# EAGLE design Tesseract (EAGLE 9.2.1)
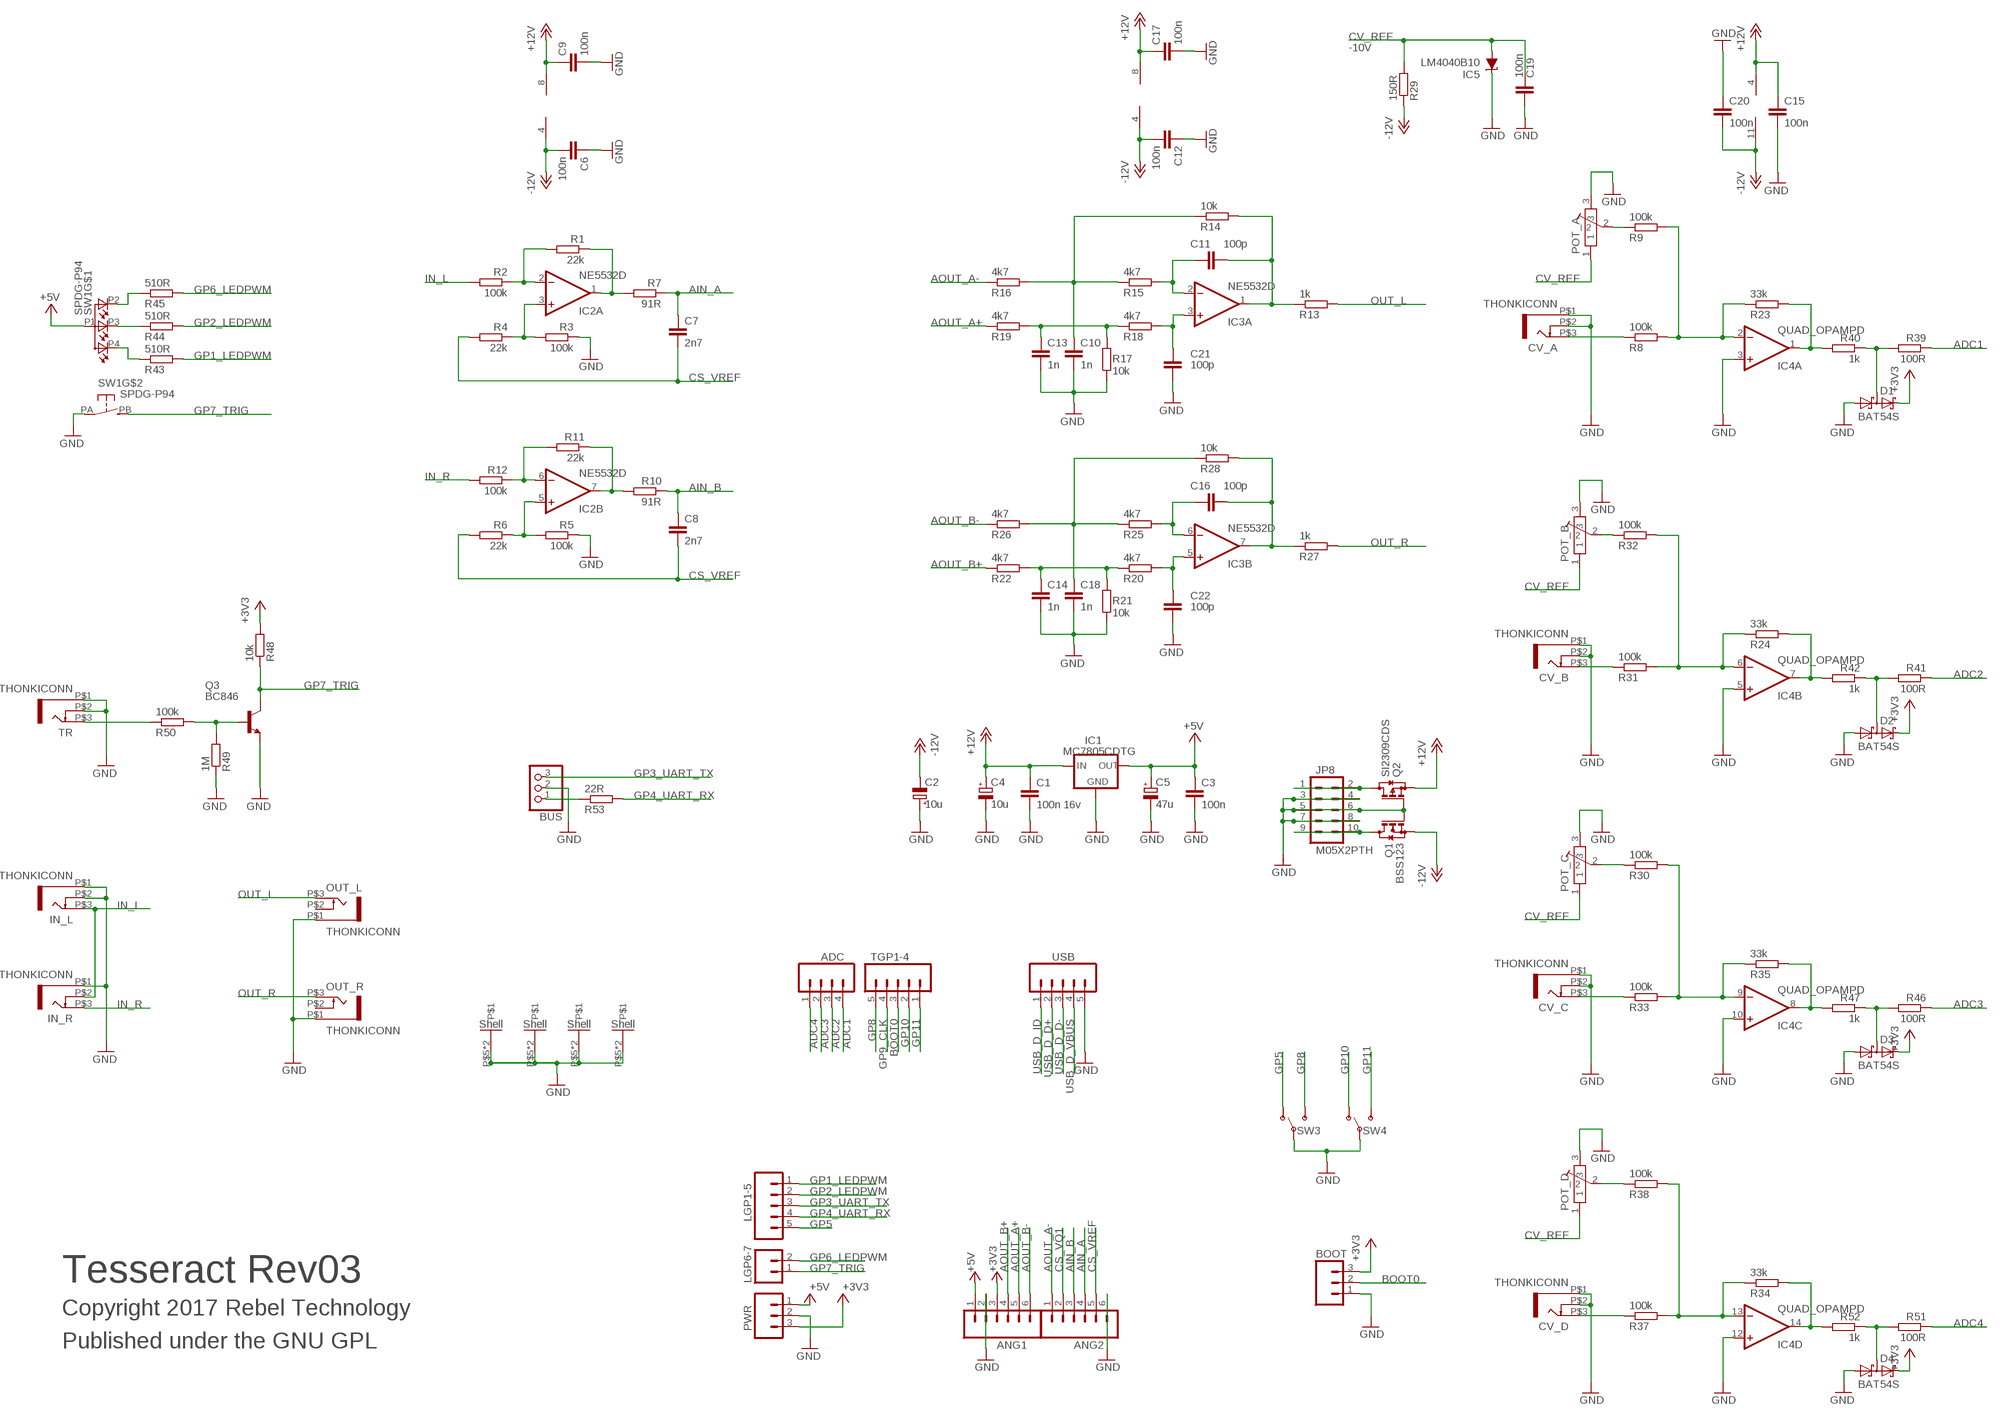
[diagram p0: schematic, sheet 1]

## Parts
ADC  M04PTH  [1X04]
ANG1  M06SIP  [1X06]
ANG2  M06SIP  [1X06]
BOOT  M03PTH  [1X03]
BUS  CON-JST-1X03PH-TH  [JST-B3B-PH-KL]
C1  100n 16v  C-EUC0603  [C0603]
C2  10u  CPOL-EU153CLV-0505  [CPOL-5]
C3  100n  C-EUC0603  [C0603]
C4  10u  CPOL-EU153CLV-0505  [CPOL-5]
C5  47u  CPOL-EUC  [PANASONIC_C]
C6  100n  C-EUC0603  [C0603]
C7  2n7  C-EUC0603  [C0603]
C8  2n7  C-EUC0603  [C0603]
C9  100n  C-EUC0603  [C0603]
C10  1n  C-EUC0603  [C0603]
C11  100p  C-EUC0603  [C0603]
C12  100n  C-EUC0603  [C0603]
C13  1n  C-EUC0603  [C0603]
C14  1n  C-EUC0603  [C0603]
C15  100n  C-EUC0603  [C0603]
C16  100p  C-EUC0603  [C0603]
C17  100n  C-EUC0603  [C0603]
C18  1n  C-EUC0603  [C0603]
C19  100n  C-EUC0603  [C0603]
C20  100n  C-EUC0603  [C0603]
C21  100p  C-EUC0603  [C0603]
C22  100p  C-EUC0603  [C0603]
CV_A  THONKICONN  [THONKICONN]
CV_B  THONKICONN  [THONKICONN]
CV_C  THONKICONN  [THONKICONN]
CV_D  THONKICONN  [THONKICONN]
D1  BAT54S  [SOT23]
D2  BAT54S  [SOT23]
D3  BAT54S  [SOT23]
D4  BAT54S  [SOT23]
IC1  MC7805CDTG  MC78XX  [DPACK]
IC2  NE5532D  [SO08]
IC3  NE5532D  [SO08]
IC4  QUAD_OPAMPD  [SO14]
IC5  LM4040B10  LM4041C12DBZ  [DBZ_R-PDSO-G3]
IN_L  THONKICONN  [THONKICONN]
IN_R  THONKICONN  [THONKICONN]
JP8  M05X2PTH  [AVR_ICSP]
LGP1-5  M05PTH  [1X05]
LGP6-7  M02PTH  [1X02]
OUT_L  THONKICONN  [THONKICONN]
OUT_R  THONKICONN  [THONKICONN]
POT_A  POT-ALPS-RK09L1140  [POT-ALPS-RK09L1140]
POT_B  POT-ALPS-RK09L1140  [POT-ALPS-RK09L1140]
POT_C  POT-ALPS-RK09L1140  [POT-ALPS-RK09L1140]
POT_D  POT-ALPS-RK09L1140  [POT-ALPS-RK09L1140]
PWR  M03PTH  [1X03]
Q1  BSS123  [SOT23]
Q2  SI2309CDS  BSS84  [SOT23]
Q3  BC846  [SOT23]
R1  22k  R-EU_0603  [0603]
R2  100k  R-EU_0603  [0603]
R3  100k  R-EU_0603  [0603]
R4  22k  R-EU_0603  [0603]
R5  100k  R-EU_0603  [0603]
R6  22k  R-EU_0603  [0603]
R7  91R  R-EU_0603  [0603]
R8  100k  R-EU_0603  [0603]
R9  100k  R-EU_0603  [0603]
R10  91R  R-EU_0603  [0603]
R11  22k  R-EU_0603  [0603]
R12  100k  R-EU_0603  [0603]
R13  1k  R-EU_0603  [0603]
R14  10k  R-EU_0603  [0603]
R15  4k7  R-EU_0603  [0603]
R16  4k7  R-EU_0603  [0603]
R17  10k  R-EU_0603  [0603]
R18  4k7  R-EU_0603  [0603]
R19  4k7  R-EU_0603  [0603]
R20  4k7  R-EU_0603  [0603]
R21  10k  R-EU_0603  [0603]
R22  4k7  R-EU_0603  [0603]
R23  33k  R-EU_0603  [0603]
R24  33k  R-EU_0603  [0603]
R25  4k7  R-EU_0603  [0603]
R26  4k7  R-EU_0603  [0603]
R27  1k  R-EU_0603  [0603]
R28  10k  R-EU_0603  [0603]
R29  150R  R-EU_0603  [0603]
R30  100k  R-EU_0603  [0603]
R31  100k  R-EU_0603  [0603]
R32  100k  R-EU_0603  [0603]
R33  100k  R-EU_0603  [0603]
R34  33k  R-EU_0603  [0603]
R35  33k  R-EU_0603  [0603]
R37  100k  R-EU_0603  [0603]
R38  100k  R-EU_0603  [0603]
R39  100R  R-EU_0603  [0603]
R40  1k  R-EU_0603  [0603]
R41  100R  R-EU_0603  [0603]
R42  1k  R-EU_0603  [0603]
R43  510R  R-EU_0603  [0603]
R44  510R  R-EU_0603  [0603]
R45  510R  R-EU_0603  [0603]
R46  100R  R-EU_0603  [0603]
R47  1k  R-EU_0603  [0603]
R48  10k  R-EU_0603  [0603]
R49  1M  R-EU_0603  [0603]
R50  100k  R-EU_0603  [0603]
R51  100R  R-EU_0603  [0603]
R52  1k  R-EU_0603  [0603]
R53  22R  R-EU_0603  [0603]
SW1  SPDG-P94  [SPDG-P94]
SW3  SUB-MIN-SPDT  [SUB-MIN-SPDT]
SW4  SUB-MIN-SPDT  [SUB-MIN-SPDT]
TGP1-4  M05PTH  [1X05]
TR  THONKICONN  [THONKICONN]
USB  M05PTH  [1X05]

## Nets
+3V3: ANG1.3 BOOT.3 D1.2(C2) D2.2(C2) D3.2(C2) D4.2(C2) PWR.3 R48.2
+5V: ANG1.1 C3.1 C5.+ IC1.3(OUT) PWR.1 SW1.P1(A)
+12V: C1.1 C4.+ C9.1 C15.1 C17.1 IC1.1(IN) IC2.8(P:V+) IC3.8(P:V+) IC4.4(P:V+) Q2.2(S)
-12V: C2.- C6.2 C12.2 C20.2 IC2.4(P:V-) IC3.4(P:V-) IC4.11(P:V-) Q1.2(S) R29.1
ADC1: ADC.4 R39.1
ADC2: ADC.3 R41.1
ADC3: ADC.2 R46.1
ADC4: ADC.1 R51.1
AIN_A: ANG2.4 C7.1 R7.1
AIN_B: ANG2.3 C8.1 R10.1
AOUT_A+: ANG1.5 R19.1
AOUT_A-: ANG2.1 R16.1
AOUT_B+: ANG1.4 R22.1
AOUT_B-: ANG1.6 R26.1
BOOT0: BOOT.2 TGP1-4.3
CS_VQ1: ANG2.2
CS_VREF: ANG2.5 C7.2 C8.2 R4.2 R6.2
CV_REF: C19.1 IC5.2(A) POT_A.1 POT_B.1 POT_C.1 POT_D.1 R29.2
EXT_UART_RX: BUS.1 R53.1
GND: ANG1.2 ANG2.6 BOOT.1 BUS.2 C1.2 C2.+ C3.2 C4.- C5.- C6.1 C9.2 C10.2 C12.1 C13.2 C14.2 C15.2 C17.2 C18.2 C19.2 C20.1 C21.2 C22.2 CV_A.P$1 CV_A.P$2 CV_B.P$1 CV_B.P$2 CV_C.P$1 CV_C.P$2 CV_D.P$1 CV_D.P$2 D1.1(A1) D2.1(A1) D3.1(A1) D4.1(A1) IC1.4(GND) IC4.3(A:+IN) IC4.5(B:+IN) IC4.10(C:+IN) IC4.12(D:+IN) IC5.1(C) IN_L.P$1 IN_L.P$2 IN_R.P$1 JP8.3 JP8.4 JP8.5 JP8.6 JP8.7 JP8.8 OUT_L.P$1 OUT_R.P$1 POT_A.3 POT_A.P$5 POT_A.P$6 POT_B.3 POT_B.P$5 POT_B.P$6 POT_C.3 POT_C.P$5 POT_C.P$6 POT_D.3 POT_D.P$5 POT_D.P$6 PWR.2 Q1.1(G) Q2.1(G) Q3.2(E) R3.1 R5.1 R17.1 R21.1 R49.1 SW1.PA(P) SW3.2(P) SW4.2(P) TR.P$1 TR.P$2 USB.5
GP1_LEDPWM: LGP1-5.1 R43.2
GP2_LEDPWM: LGP1-5.2 R44.2
GP3_UART_TX: BUS.3 LGP1-5.3
GP4_UART_RX: LGP1-5.4 R53.2
GP5: LGP1-5.5 SW3.1(O)
GP6_LEDPWM: LGP6-7.2 R45.2
GP7_TRIG: LGP6-7.1 Q3.3(C) R48.1 SW1.PB(S)
GP8: SW3.3(S) TGP1-4.5
GP9_CLK: TGP1-4.4
GP10: SW4.1(O) TGP1-4.2
GP11: SW4.3(S) TGP1-4.1
IN_L: IN_L.P$3 IN_R.P$2 R2.2
IN_R: IN_R.P$3 R12.2
N$1: IC2.1(A:OUT) R1.1 R7.2
N$2: IC2.3(A:+IN) R3.2 R4.1
N$3: CV_A.P$3 R8.1
N$4: IC2.5(B:+IN) R5.2 R6.1
N$5: IC2.6(B:-IN) R11.2 R12.1
N$6: IC4.9(C:-IN) R30.2 R33.2 R35.1
N$7: C11.1 IC3.2(A:-IN) R15.2
N$8: JP8.9 JP8.10 Q1.3(D)
N$9: IC2.2(A:-IN) R1.2 R2.1
N$10: IC2.7(B:OUT) R10.2 R11.1
N$11: C21.1 IC3.3(A:+IN) R18.2
N$12: JP8.1 JP8.2 Q2.3(D)
N$13: IC4.2(A:-IN) R8.2 R9.2 R23.1
N$14: POT_A.2 R9.1
N$15: C13.1 R17.2 R18.1 R19.2
N$16: D1.3(C1A2) R39.2 R40.1
N$17: IC4.1(A:OUT) R23.2 R40.2
N$18: C16.2 IC3.7(B:OUT) R27.1 R28.2
N$19: CV_B.P$3 R31.1
N$20: IC4.6(B:-IN) R24.1 R31.2 R32.2
N$21: POT_B.2 R32.1
N$22: IC4.7(B:OUT) R24.2 R42.2
N$23: D2.3(C1A2) R41.2 R42.1
N$24: C18.1 R25.1 R26.2 R28.1
N$25: CV_C.P$3 R33.1
N$26: C16.1 IC3.6(B:-IN) R25.2
N$27: POT_C.2 R30.1
N$28: IC4.8(C:OUT) R35.2 R47.2
N$29: D3.3(C1A2) R46.2 R47.1
N$30: C22.1 IC3.5(B:+IN) R20.2
N$31: CV_D.P$3 R37.1
N$32: C14.1 R20.1 R21.2 R22.2
N$33: IC4.13(D:-IN) R34.1 R37.2 R38.2
N$34: POT_D.2 R38.1
N$35: IC4.14(D:OUT) R34.2 R52.2
N$36: D4.3(C1A2) R51.2 R52.1
N$37: Q3.1(B) R49.2 R50.2
N$39: C11.2 IC3.1(A:OUT) R13.1 R14.2
N$40: R43.1 SW1.P4(CRED)
N$41: C10.1 R14.1 R15.1 R16.2
N$42: R45.1 SW1.P2(CGREEN)
N$43: R44.1 SW1.P3(CBLUE)
N$46: R50.1 TR.P$3
OUT_L: OUT_L.P$3 R13.2
OUT_R: OUT_R.P$3 R27.2
USB_D_D+: USB.2
USB_D_D-: USB.3
USB_D_ID: USB.1
USB_D_VBUS: USB.4
Unconnected: OUT_L.P$2 OUT_R.P$2

## Notes on the sheet
- -10V
- Tesseract Rev03
- Copyright 2017 Rebel Technology
- Published under the GNU GPL

## Library data of the parts
ADC = SparkFun:M04: Header 4 Standard 4-pin 0.1" header. Use with straight break away headers (SKU : PRT-00116), right angle break away headers (PRT-00553), swiss pins (PRT-00743), machine pins (PRT-00117), and female headers (PRT-00115). Molex polarized connector foot print use with SKU : PRT-08231 with associated crimp pins and housings. 1MM SMD Version SKU: PRT-10208
ANG1 ANG2 = SparkFun:M06: Header 6 Standard 6-pin 0.1" header. Use with straight break away headers (SKU : PRT-00116), right angle break away headers (PRT-00553), swiss pins (PRT-00743), machine pins (PRT-00117), and female headers (PRT-00115). Molex polarized connector foot print use with SKU : PRT-08094 with associated crimp pins and housings. NOTES ON THE VARIANTS LOCK and LOCK_LONGPADS... This footprint was designed to help hold the alignment of a through-hole component (i.e. 6-pin header) while soldering it into place. You may notice that each hole has been shifted either up or down by 0.005 of an inch from it's more standard position (which is a perfectly straight line). This slight alteration caused the pins (the squares in the middle) to touch the edges of the holes. Because they are alternating, it causes a "brace" to hold the component in place. 0.005 has proven to be the perfect amount of "off-center" position when using our standard breakaway headers. Although looks a little odd when you look at the bare footprint, once you have a header in there, the alteration is very hard to notice. Also, if you push a header all the way into place, it is covered up entirely on the bottom side. This idea of altering the position of holes to aid alignment will be further integrated into the Sparkfun Library for other footprints. It can help hold any component with 3 or more connection pins.
BOOT PWR = SparkFun:M03: Header 3 Standard 3-pin 0.1" header. Use with straight break away headers (SKU : PRT-00116), right angle break away headers (PRT-00553), swiss pins (PRT-00743), machine pins (PRT-00117), and female headers (PRT-00115). Molex polarized connector foot print use with SKU : PRT-08232 with associated crimp pins and housings.
BUS = Rebel:CON-JST-1X03
C1 C3 = Rebel:C-EU: CAPACITOR, European symbol
C2 C4 = Rebel:CPOL-EU: POLARIZED CAPACITOR, European symbol
C5 = rcl:CPOL-EU: POLARIZED CAPACITOR, European symbol
C6-C22 = resistor:C-EU: CAPACITOR, European symbol
CV_A CV_B CV_C CV_D IN_L IN_R OUT_L OUT_R TR = Rebel:THONKICONN
D1-D4 = diode:BAT54S: Schottky Diodes Pin connection corrected 2011-05-04 Source: Fairchild .. BAT54.pdf
IC1 = James:MC78XX: VOLTAGE REGULATOR; OC_FARNELL: 2296028
IC2 IC3 = linear:NE5532: AUDIO AMPLIFIER
IC4 = adafruit:QUAD_OPAMP: OP AMP Standard quad package
IC5 = texas:LM4041: PRECISION MICROPOWER SHUNT VOLTAGE REFERENCE Source: http://focus.ti.com/lit/ds/slcs146e/slcs146e.pdf; MF: TEXAS INSTRUMENT CONNECTORS; MPN: LM4041C12QDBZT; OC_FARNELL: 1771733; OC_NEWARK: 43K3376
JP8 = SparkFun:M05X2: Header 5x2 Standard 10-pin dual row 0.1" header. Commonly used with AVR-ISP. Use with Spark Fun Electronics SKU: PRT-00778
LGP1-5 TGP1-4 USB = SparkFun:M05: Header 5 Standard 5-pin 0.1" header. Use with straight break away headers (SKU : PRT-00116), right angle break away headers (PRT-00553), swiss pins (PRT-00743), machine pins (PRT-00117), and female headers (PRT-00115). Molex polarized connector foot print use with SKU : PRT-08230 with associated crimp pins and housings.
LGP6-7 = SparkFun:M02: Header 2 Standard 2-pin 0.1" header. Use with straight break away headers (SKU : PRT-00116), right angle break away headers (PRT-00553), swiss pins (PRT-00743), machine pins (PRT-00117), and female headers (PRT-00115). Molex polarized connector foot print use with SKU : PRT-08233 with associated crimp pins and housings.
POT_A POT_B POT_C POT_D = Rebel:POT-ALPS-RK09L
Q1 = transistor-small-signal:BSS123: N-CHANNEL MOS FET; OC_FARNELL: 1843725
Q2 = transistor-small-signal:BSS84: P-CHANNEL MOS FET; OC_FARNELL: 1779264
Q3 = transistor:BC846: NPN TRANSISTOR
R1-R35 R37-R53 = Rebel:R-EU_: RESISTOR, European symbol
SW1 = Rebel:SPDG-P94
SW3 SW4 = Rebel:SUB-MIN-SPDT

## Net classes
1 power: width 0.178 mm, drill 0.305 mm, clearance 0.178 mm to class 0, clearance 0.178 mm

## Board
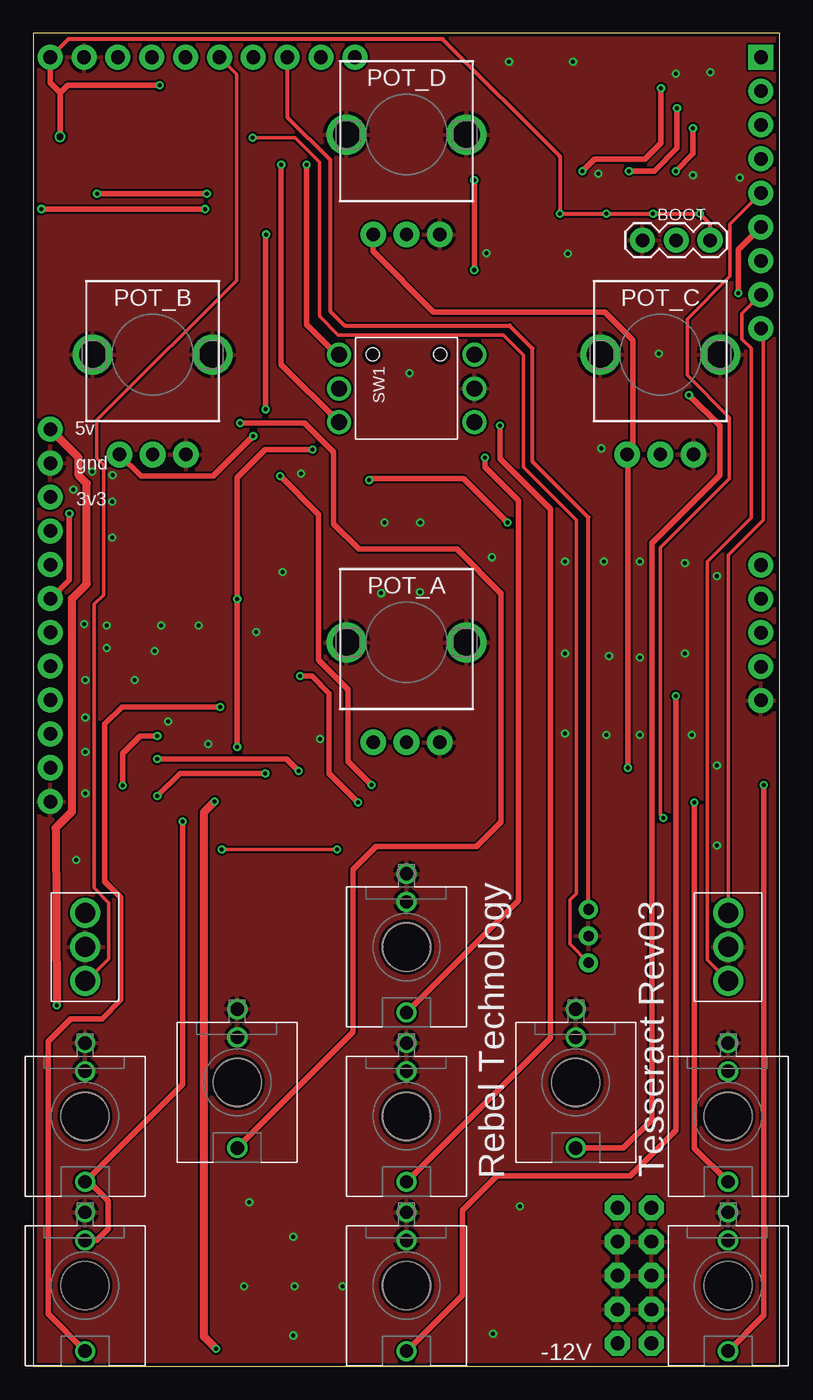
[diagram p1: board, top side]
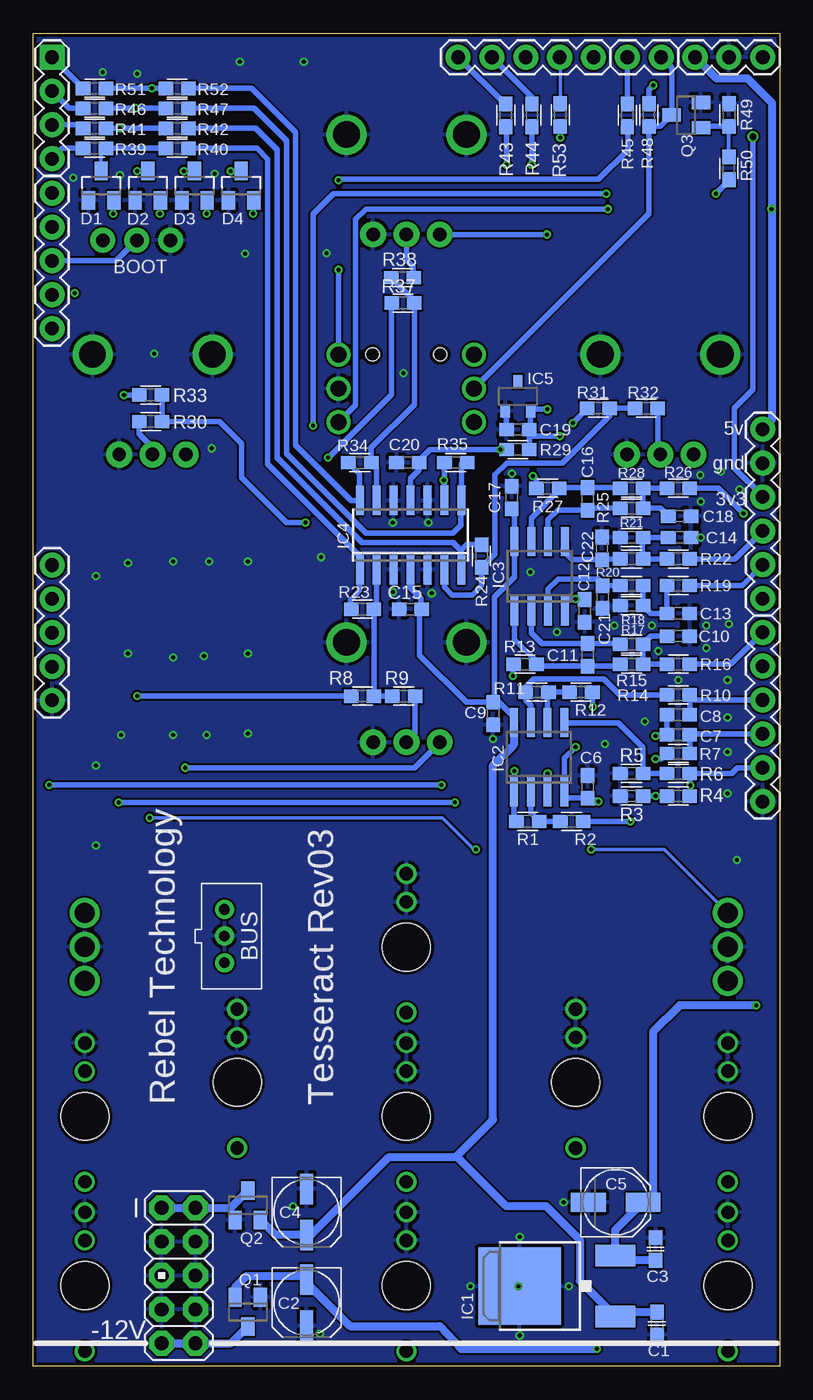
[diagram p2: board, bottom side, seen from below]

Size 56 x 100 mm. Coordinates in mm from the lower left corner, seen from the top.
Outline: 0,0 56,0 56,100 0,100 0,0
Copper layers (1*16): Top 0.035mm / dielectric 1.5mm / Bottom 0.035mm
Design rules "SeeedStudio_2layer_DRU_no_angle_20140221": minimum track width 6mil, minimum drill 12mil, track to track 6mil, track to pad 6mil, pad to pad 6mil, via to via 6mil, smd to smd 0mil, copper to edge 10mil, drill to drill 10mil, minimum pad ring 10mil, minimum via ring 6mil, stop-mask expansion 2mil, vias tented up to drill 100mil, thermal gap 10mil

### Footprints (pad centres in the part's own frame; a part is rotated, then mirrored left to right if it is on the bottom)
1X04 = drill 1.016 pad 1.88 square: 1 0,0 | drill 1.016 pad 1.88: 2 2.54,0; 3 5.08,0; 4 7.62,0
1X06 = drill 1.016 pad 1.88: 1 0,0; 2 2.54,0; 3 5.08,0; 4 7.62,0; 5 10.16,0; 6 12.7,0
1X03 = drill 1.016 pad 1.88: 1 0,0; 2 2.54,0; 3 5.08,0
JST-B3B-PH-KL = drill 0.8 pad 1.422: 1 2,0; 2 0,0; 3 -2,0
C0603 = smd 1.1 x 1: 1 -0.85,0; 2 0.85,0
CPOL-5 = smd 2.3 x 1: + 1.725,0; - -1.725,0
PANASONIC_C = smd 2.6 x 1.4: + 2.05,0; - -2.05,0
THONKICONN = drill 1: P$1 0,-5.5; P$2 0,-3.38; P$3 0,4.92 | hole 3.6: 0,0
SOT23 = smd 1 x 1.4: 1 -0.95,-1.1; 2 0.95,-1.1; 3 0,1.1
DPACK = smd 1.6 x 3: 1 -2.28,-4.8; 3 2.28,-4.8 | smd 5.8 x 6.2: 4 0,2.38
SO08 = smd 0.6 x 2.2: 1 -1.905,-2.6; 2 -0.635,-2.6; 3 0.635,-2.6; 4 1.905,-2.6; 5 1.905,2.6; 6 0.635,2.6; 7 -0.635,2.6; 8 -1.905,2.6
SO14 = smd 0.6 x 2.2: 1 -3.81,-2.6; 2 -2.54,-2.6; 3 -1.27,-2.6; 4 0,-2.6; 5 1.27,-2.6; 6 2.54,-2.6; 7 3.81,-2.6; 8 3.81,2.6; 9 2.54,2.6; 10 1.27,2.6; 11 0,2.6; 12 -1.27,2.6; 13 -2.54,2.6; 14 -3.81,2.6
DBZ_R-PDSO-G3 = smd 0.7 x 1: 1 -0.95,-1.1; 2 0.95,-1.1; 3 0,1.1
AVR_ICSP = drill 1.016 pad 1.88 octagon: 1 -1.27,5.08; 2 1.27,5.08; 3 -1.27,2.54; 4 1.27,2.54; 5 -1.27,0; 6 1.27,0; 7 -1.27,-2.54; 8 1.27,-2.54; 9 -1.27,-5.08; 10 1.27,-5.08
1X05 = drill 1.016 pad 1.88: 1 0,0; 2 2.54,0; 3 5.08,0; 4 7.62,0; 5 10.16,0
1X02 = drill 1.016 pad 1.88: 1 0,0; 2 2.54,0
POT-ALPS-RK09L1140 = drill 1 pad 1.93: 1 -2.5,-7.5; 2 0,-7.5; 3 2.5,-7.5 | drill 2: P$5 -4.5,0; P$6 4.5,0
0603 = smd 1.1 x 1: 1 -0.85,0; 2 0.85,0
SPDG-P94 = drill 1.2: P1 5.08,-2.54; P2 5.08,2.54; P3 -5.08,-2.54; P4 -5.08,2.54; PA 5.08,0; PB -5.08,0 | hole 1: 2.54,2.54; -2.54,2.54
SUB-MIN-SPDT = drill 1.5: 1 0,-2.54; 2 0,0; 3 0,2.54

### Placement (x,y rotation side)
ADC  54.6,98.21 270 bottom
ANG1  1.27,70.29 270 bottom
ANG2  1.27,55.06 270 bottom
BOOT  45.7,84.47 0 top
BUS  41.66,32.27 270 bottom
C1  9.2,3.2 270 bottom
C2  35.5,4.77 270 bottom
C3  9.3,8.8 90 bottom
C4  35.5,11.57 270 bottom
C5  12.3,12.3 0 bottom
C6  14.4,43.47 270 bottom
C7  7.6,47.37 180 bottom
C8  7.6,48.87 180 bottom
C9  21.5,48.97 270 bottom
C10  7.6,54.77 0 bottom
C11  14.4,53.37 270 bottom
C12  14.62,56.67 90 bottom
C13  7.6,56.47 0 bottom
C14  7.5,62.17 0 bottom
C15  27.7,56.79 180 bottom
C16  14.4,65.07 90 bottom
C17  20.1,65.17 90 bottom
C18  7.5,63.77 0 bottom
C19  19.63,70.27 180 bottom
C20  27.9,67.79 0 bottom
C21  13.28,57.71 270 bottom
C22  13.32,61.36 90 bottom
CV_A  28,6.05 180 top
CV_B  15.3,21.29 180 top
CV_C  40.7,21.29 180 top
CV_D  28,31.45 180 top
D1  50.9,88.57 0 bottom
D2  47.4,88.57 0 bottom
D3  43.9,88.57 0 bottom
D4  40.4,88.57 0 bottom
IC1  17.13,6.01 90 bottom
IC2  18.04,45.7 0 bottom
IC3  18,59.27 0 bottom
IC4  27.69,62.36 0 bottom
IC5  19.63,72.77 0 bottom
IN_L  3.87,18.75 180 top
IN_R  3.87,6.05 180 top
JP8  45.1,6.8 0 bottom
LGP1-5  24.12,98.21 0 bottom
LGP6-7  8.88,98.21 180 bottom
OUT_L  52.13,18.75 180 top
OUT_R  52.13,6.05 180 top
POT_A  28,54.31 0 top
POT_B  8.95,75.9 0 top
POT_C  47.05,75.9 0 top
POT_D  28,92.41 0 top
PWR  6.34,98.21 0 bottom
Q1  39.9,4.07 180 bottom
Q2  39.9,12.07 0 bottom
Q3  7,93.87 90 bottom
R1  18.9,40.87 0 bottom
R2  15.6,40.87 0 bottom
R3  11.1,42.77 0 bottom
R4  7.6,42.77 0 bottom
R5  11.1,44.47 0 bottom
R6  7.6,44.47 0 bottom
R7  7.6,45.97 180 bottom
R8  31.3,50.27 0 bottom
R9  28.2,50.27 180 bottom
R10  7.6,50.37 180 bottom
R11  18.2,50.57 0 bottom
R12  14.9,50.57 0 bottom
R13  19.1,52.67 180 bottom
R14  11.1,52.67 180 bottom
R15  11.1,54.17 180 bottom
R16  7.6,52.67 180 bottom
R17  11.1,57.07 0 bottom
R18  11.1,58.57 180 bottom
R19  7.6,58.57 180 bottom
R20  11.1,60.57 180 bottom
R21  11.1,62.17 0 bottom
R22  7.6,60.57 180 bottom
R23  31.3,56.79 180 bottom
R24  22.35,60.78 90 bottom
R25  11.1,64.37 180 bottom
R26  7.6,65.87 180 bottom
R27  17.4,65.87 180 bottom
R28  11.1,65.87 180 bottom
R29  19.63,68.77 0 bottom
R30  47.2,70.87 0 bottom
R31  13.6,71.87 0 bottom
R32  10,71.87 180 bottom
R33  47.2,72.87 0 bottom
R34  31.5,67.79 180 bottom
R35  24.3,67.79 0 bottom
R37  28.25,79.77 0 bottom
R38  28.3,81.67 180 bottom
R39  51.4,91.37 0 bottom
R40  45.2,91.37 0 bottom
R41  51.4,92.87 0 bottom
R42  45.2,92.87 0 bottom
R43  20.54,93.85 90 bottom
R44  18.58,93.85 90 bottom
R45  11.42,93.85 90 bottom
R46  51.4,94.37 0 bottom
R47  45.2,94.37 0 bottom
R48  9.8,93.87 90 bottom
R49  3.8,93.87 270 bottom
R50  3.8,89.87 90 bottom
R51  51.4,95.87 0 bottom
R52  45.2,95.87 0 bottom
R53  16.46,93.87 90 bottom
SW1  28,73.36 0 top
SW3  3.87,31.45 0 top
SW4  52.13,31.45 0 top
TGP1-4  54.6,77.85 90 bottom
TR  28,18.75 180 top
USB  54.6,60.11 270 bottom

### Tracks (layer width: path | path; a pad name or v marks a point on that pad's centre or on a via)
+3V3  (via drill 0.3, 0.5)
  Top 0.305: BOOT.3 50.78,85.69 v50,86.47 v46.5,86.47 v43,86.47 v39.5,86.47 39.5,90.77 30.7,99.57 2.62,99.57 PWR.3
  Top 0.406: PWR.3 1.26,96.28 2,95.54 | 2,95.54 v2,92.24 | v9.46,96.09 2.55,96.09 2,95.54
  Bottom 0.305: 39.5,87.42 arc90 D4.2 arc-90 39.5,87.42 | 43,87.42 arc90 D3.2 arc-90 43,87.42 | 46.5,87.42 arc90 D2.2 arc-90 46.5,87.42 | 50,87.42 arc90 D1.2 arc-90 50,87.42 | v39.5,86.47 39.5,87.42 | v43,86.47 43,87.42 | v46.5,86.47 46.5,87.42 | v50,86.47 50,87.42
  Bottom 0.406: D4.2 39.45,86.52 v39.5,86.47 | ANG1.3 1.27,65.27 3.38,67.38 3.38,71.89 2,73.27 v2,92.24 | R48.2 9.8,95.75 v9.46,96.09
+5V  (via drill 0.3)
  Top 0.406: v12.89,86.82 v0.6,86.82
  Top 0.61: ANG1.1 3.36,68.2 3.36,66.87 4,66.23 4,58.7 2.9,57.6 2.9,41.61 1.66,40.37 v1.76,27.07
  Bottom 0.406: 9.5,13.05 C5.+ | SW1.P1 31.81,72.09 31.81,84.35 31.82,84.36 31.82,85.46 31.81,85.47 31.81,86.06 31.05,86.82 v12.89,86.82
  Bottom 0.61: ANG1.1 0.6,70.96 v0.6,86.82 0.6,94.81 2.42,96.62 4.73,96.62 PWR.1 | 9.5,13.05 9.5,25.07 7.5,27.07 v1.76,27.07 | C3.1 11.99,7.95 IC1.3 12.33,10.22 C5.+
+12V
  Bottom 0.406: C17.1 19.9,64.12 19.9,62.42 IC3.8 19.9,59.2 21.4,57.7 21.4,53.89 21.4,49.92 C9.1 | IC4.4 27.69,58.38 26.9,57.59 26.9,56.84 C15.1 27,56.74 27,53.31 23.51,49.82 C9.1 | IC2.8 19.95,48.71 21.05,49.82 C9.1
  Bottom 0.61: 24.25,15.75 24.3,15.7 29.3,15.7 35.12,9.88 35.46,9.88 C4.+ 37.83,9.85 Q2.2 | 24.25,15.75 21.5,18.5 21.5,45.07 19.95,46.62 IC2.8 | C1.1 12.01,4.05 IC1.1 15,6.4 15,9.5 17.5,12 20.5,12 24.25,15.75
-12V  (via drill 0.3)
  Top 0.406: v15.3,46.47 v15.3,57.57 15.3,66.67 17.4,68.77 v20.95,68.77
  Top 0.61: v13.7,1.3 12.8,2.2 12.8,41.57 v13.6,42.37
  Bottom 0.406: C12.2 15.25,57.52 | IC3.4 16,57.52 15.25,57.52 | v15.3,57.57 15.25,57.52 | C6.2 16.05,42.62 IC2.4 16.13,45.63 v15.3,46.47 | IC4.11 27.69,66.59 27.05,67.23 27.05,67.96 | R29.1 v20.95,68.77 26.24,68.77 27.05,67.96 | 27.05,67.96 C20.2
  Bottom 0.61: v13.7,1.3 23.9,1.3 25.5,3 32.23,3 35.5,6.27 C2.- 35.78,6.77 40,6.77 40.85,5.92 Q1.2 | v13.6,42.37 14.25,42.37 C6.2
ADC1
  Bottom 0.406: R39.1 53.82,91.37 ADC.4
ADC2
  Bottom 0.406: R41.1 52.51,93.13 ADC.3
ADC3
  Bottom 0.406: R46.1 53.3,94.37 ADC.2
ADC4
  Bottom 0.406: R51.1 ADC.1
AIN_A
  Bottom 0.406: R7.1 C7.1 arc90 6.68,47.44 ANG2.4
AIN_B
  Bottom 0.406: C8.1 R10.1 6.36,49.98 ANG2.3
AOUT_A+
  Bottom 0.406: ANG1.5 1.24,60.13 2.8,58.57 R19.1
AOUT_A-
  Bottom 0.406: R16.1 3.66,52.67 ANG2.1
AOUT_B+
  Bottom 0.406: R22.1 3.37,60.57 ANG1.4
AOUT_B-  (via drill 0.3)
  Top 0.406: ANG1.6 1.32,57.59 2.7,58.97 v2.7,63.97
  Bottom 0.406: R26.1 4.6,65.87 v2.7,63.97
BOOT0
  Bottom 0.406: TGP1-4.3 49.78,82.93 BOOT.2
CS_VREF  (via drill 0.3)
  Top 0.406: v6.7,43.57 6.7,45.97 8,47.27 v9.3,47.27
  Bottom 0.406: C8.2 C7.2 9.2,47.37 v9.3,47.27 | ANG2.5 3.17,44.9 3.6,44.47 R6.2 R4.2 6.75,43.52 v6.7,43.57
CV_REF  (via drill 0.3)
  Top 0.406: v44.6,44.9 44.6,68.35 POT_C.1 45,68.85 45,76.98 42.88,79.1 30.04,79.1 25.5,83.64 POT_D.1 | v17.45,84.91 17.41,84.87 v17.41,71.79 | v16.5,69.77 13.5,66.77 8.08,66.77 POT_B.1
  Bottom 0.305: 18.68,70.27 C19.1
  Bottom 0.406: R29.2 18.78,69.77 | 18.78,69.77 C19.1 | POT_A.1 25.95,46.35 27.4,44.9 v44.6,44.9 | 18.68,70.27 IC5.2 18.56,71.79 v17.41,71.79 | v16.5,69.77 18.78,69.77 | POT_D.1 v17.45,84.91
EXT_UART_RX  (via drill 0.3)
  Top 0.254: v16.46,92.17 19.62,92.17 21.46,90.33 21.46,78.77 22.86,77.37 35.26,77.37 36.76,75.87 36.76,67.47 40.76,63.47 40.76,35.47 40.26,34.97 40.26,31.67 BUS.1
  Bottom 0.406: v16.46,92.17 R53.1
GND  (via drill 0.3)
  Bottom 0.406: C19.2 20.48,71.57 IC5.1
  other vias: 16.2,12.3 19.5,9.7 19.5,2.3 23.2,6 28.21,74.51 18.7,59.57 5.5,55.57 7.6,51.47 13.1,46.67 20.08,66.97 21.5,47.07 29,58.09 26.36,63.29 34.4,60.69 19.6,6 15.8,6 34.5,2.44 36.5,12 5.9,64.87 26.1,57.99 5.5,53.87 5.9,62.17 9.59,55.57 12.4,55.57 16.7,55.07 10.1,48.37 3,65.77 51.3,39.07 51.3,45.07 51.3,59.27 3.2,37.97 3.9,46.07 3.9,48.67 3.9,51.47 3.8,55.67 5.93,66.86 3.9,42.97 39.9,47.47 39.9,53.47 39.9,60.37 43,47.37 49.4,47.37 48.9,53.47 48.9,60.27 42.8,60.37 43.2,53.27 45.5,47.37 45.5,53.17 45.5,60.37 42.62,68.86 40.1,83.47 33.99,83.5 35.7,97.87 40.5,97.87 42.4,89.47 49.5,89.37 53,89.17 50.8,97.07 48.2,96.97 29.03,63.29 4.41,67.11 9.08,53.66 46.94,75.98
  pour Bottom: -2.1,-1 -2,101.27 58,101.27 58.5,-1.5
  pour Top: -2,-1 -1.9,101.27 58.1,101.27 58,-1
GP1_LEDPWM
  Bottom 0.406: LGP1-5.1 20.61,94.7 R43.2
GP2_LEDPWM
  Bottom 0.305: R44.2 18.58,95.21
  Bottom 0.406: 18.58,95.21 LGP1-5.2
GP3_UART_TX
  Top 0.305: LGP1-5.3 19.04,93.72 22.26,90.5 22.26,79.17 23.36,78.07 35.74,78.07 37.46,76.35 37.46,67.87 41.66,63.67 BUS.3
GP4_UART_RX
  Bottom 0.254: LGP1-5.4 16.46,98.21 R53.2
GP5
  Top 0.254: SW3.1 4,28.91 5.66,30.57 5.66,34.77 4.56,35.87 4.56,57.17 5.26,57.87 5.26,67.63 4.76,68.13 4.76,70.97 5.36,71.57 15.23,81.44 15.23,96.94 LGP1-5.5
GP6_LEDPWM
  Bottom 0.406: R45.2 LGP6-7.2
GP7_TRIG
  Bottom 0.406: LGP6-7.1 8.1,97.43 Q3.3 8.95,93.02 R48.1 9.8,86.48 SW1.PB
GP8  (via drill 0.3)
  Top 0.254: TGP1-4.5 52.26,85.67 52.26,81.77 49.06,78.57 49.06,74.34 52.23,71.17 52.23,66.6 47.05,61.41 47.05,41.35 v47.26,41.14 | v22.79,38.77 v14.14,38.77
  Bottom 0.254: v47.26,41.14 25.29,41.14 22.91,38.77 v22.79,38.77 | v14.14,38.77 8.65,38.77 SW3.3
GP9_CLK  (via drill 0.3)
  Top 0.406: v52.9,80.5 52.9,83.77 TGP1-4.4
GP10
  Top 0.254: TGP1-4.2 53.16,78.95 53.16,77.07 53.86,76.37 53.86,63.67 50.56,60.37 50.56,30.48 SW4.1
GP11
  Top 0.254: SW4.3 52.13,60.84 54.76,63.47 54.76,77.69 TGP1-4.1
IN_L  (via drill 0.3)
  Top 0.406: v11.2,40.87 11.2,21.16 IN_L.P$3 3.87,13.63 4.37,13.63 5.6,12.4 5.6,10.3 4.73,9.43 IN_R.P$2
  Bottom 0.406: R2.2 v11.2,40.87
IN_R  (via drill 0.3)
  Top 0.406: v14,49.47 6.66,49.47 5.36,48.17 5.36,36.37 6.56,35.17 6.56,27.47 5.16,26.07 2.8,26.07 1.1,24.37 1.1,3.92 IN_R.P$3
  Bottom 0.406: R12.2 14.05,49.72 v14,49.47
N$1  (via drill 0.3)
  Top 0.406: v9.3,45.57 19,45.57 v19.9,44.67
  Bottom 0.406: v19.9,44.67 19.9,43.14 IC2.1 19.95,41.06 R1.1 | R7.2 8.5,45.97 8.9,45.57 v9.3,45.57
N$2  (via drill 0.3)
  Top 0.406: v17.4,44.47 11,44.47 v9.3,42.77
  Bottom 0.406: R3.2 v9.3,42.77 R4.1 | v17.4,44.47 IC2.3
N$3  (via drill 0.3)
  Top 0.406: v48.2,50.27 48.2,17.7 44.8,14.3 34.8,14.3 32.2,11.7 32.2,5.33 CV_A.P$3
  Bottom 0.406: R8.1 v48.2,50.27
N$4
  Bottom 0.406: R6.1 R5.2 10.25,46.42 12.1,48.27 16.11,48.27 IC2.5
N$5
  Bottom 0.406: IC2.6 17.4,50.52 R11.2 R12.1
N$6  (via drill 0.3)
  Top 0.406: v25.2,66.49 25.2,66.55 25.23,66.58 32.28,66.58 v35.59,63.28
  Bottom 0.406: R33.2 R30.2 42.02,70.87 40.36,69.21 40.36,66.66 36.98,63.28 v35.59,63.28 | IC4.9 R35.1 25.15,66.54 arc90 v25.2,66.49
N$7
  Bottom 0.406: R15.2 11.95,54.22 C11.1 17.85,54.22 18.63,55 IC3.2
N$8
  Bottom 0.61: JP8.9 JP8.10 41.15,1.72 Q1.3
N$9
  Bottom 0.406: IC2.2 18.67,41.49 R1.2 R2.1
N$10
  Bottom 0.406: R10.2 12,50.37 13.2,51.57 18.43,51.57 19.05,50.95 R11.1 19.05,49.93 18.67,49.56 IC2.7
N$11
  Bottom 0.406: R18.2 13,58.57 13.28,58.85 | IC3.3 17.36,58.3 16.6,59.07 13.9,59.07 13.58,59.05 13.28,58.85 | C21.1 13.28,58.85
N$12
  Bottom 0.61: JP8.1 JP8.2 41.19,11.88 Q2.3
N$13
  Bottom 0.406: R9.2 R8.2 R23.1 30.23,56.81 IC4.2
N$14
  Bottom 0.406: R9.1 27.35,47.46 POT_A.2
N$15
  Bottom 0.406: R18.1 R17.2 9.65,56.47 C13.1 R19.2
N$16
  Bottom 0.305: D1.3 50.9,91.02
  Bottom 0.406: 50.9,91.02 arc90 R39.2 R40.1
N$17
  Bottom 0.406: R40.2 39.2,91.37 38.4,90.57 38.4,67.69 31.47,60.76 31.47,59.73 IC4.1 31.5,58.19 32.2,57.49 32.2,56.84 R23.2
N$18
  Bottom 0.406: R28.2 12,65.92 C16.2 16.35,65.92 16.55,65.72 | IC3.7 18.63,63.63 16.55,65.72 | R27.1 16.55,65.72
N$19  (via drill 0.3)
  Top 0.406: CV_B.P$3 24,25.07 24,37.27 25.72,38.99 33.26,38.99 35.1,40.83 35.1,57.98 31.81,61.27 31.81,61.3 24.44,61.3 22.54,63.2 22.54,68.58 20.35,70.77 v15.5,70.77
  Bottom 0.406: R31.1 14.9,71.37 v15.5,70.77
N$20
  Bottom 0.406: R32.2 R31.2 12.75,71.32 16.3,67.77 20.46,67.77 21.34,66.89 21.34,60.94 R24.1 22.35,58.56 23.05,57.87 24.57,57.87 25.15,58.45 IC4.6
N$21
  Bottom 0.406: R32.1 9.15,68.57 POT_B.2
N$22
  Bottom 0.406: R42.2 39.31,92.87 37.7,91.26 37.7,68.17 31.32,61.79 24.5,61.79 23.91,61.2 | 23.91,61.2 23.9,61.19 23.9,59.78 IC4.7 | R24.2 23.48,61.63 23.91,61.2
N$23  (via drill 0.3)
  Top 0.406: v48.2,89.67 49.5,90.97 v49.5,92.87
  Bottom 0.406: R42.1 v49.5,92.87 R41.2 | D2.3 v48.2,89.67
N$24
  Bottom 0.406: R26.2 R28.1 R25.1 8.95,64.37 C18.1
N$25  (via drill 0.3)
  Top 0.406: v49.2,72.87 51.5,70.57 51.5,66.87 46.4,61.77 46.4,18.5 44.27,16.37 CV_C.P$3
  Bottom 0.406: R33.1 v49.2,72.87
N$26
  Bottom 0.406: IC3.6 17.36,63.5 16.65,64.22 C16.1 arc90 14.25,64.37 R25.2
N$27
  Bottom 0.305: 48.05,69.92 48,69.87
  Bottom 0.406: POT_C.2 47.05,68.92 48,69.87 | R30.1 48.05,69.92
N$28
  Bottom 0.406: R35.2 23.88,67.72 IC4.8 23.9,64.94 23.9,63.09 24.5,62.49 31.02,62.49 37,68.47 37,91.93 39.44,94.37 R47.2
N$29  (via drill 0.3)
  Top 0.406: v44.7,89.67 46.6,89.67 48.3,91.37 v48.3,94.37
  Bottom 0.406: R47.1 v48.3,94.37 R46.2 | v44.7,89.67 D3.3
N$30
  Bottom 0.406: R20.2 13.26,60.57 C22.1 15.54,60.51 16,60.97 16,61.07 16,61.77 IC3.5
N$31  (via drill 0.3)
  Top 0.406: CV_D.P$3 36.4,34.93 36.4,64.93 33.88,67.44 v33.88,68.16
  Bottom 0.406: v33.88,68.16 33.86,68.16 29.11,72.91 R37.1
N$32
  Bottom 0.406: C14.1 R21.2 10.3,61.57 10.3,60.27 10.35,60.62 R20.1 R22.2
N$33
  Bottom 0.406: IC4.13 30.23,67.37 R34.1 30.65,68.9 27.4,72.14 R37.2 27.4,79.92 R38.2
N$34
  Bottom 0.406: POT_D.2 28,83 27.5,82.5 27.5,81.72 R38.1
N$35
  Bottom 0.406: R52.2 39.61,95.87 36.3,92.56 36.3,69.1 32.16,64.96 IC4.14 31.5,66.94 R34.2
N$36  (via drill 0.3)
  Top 0.406: v41.2,89.67 42.1,90.57 45.9,90.57 47.1,91.77 v47.1,95.87
  Bottom 0.406: R51.2 v47.1,95.87 R52.1 | v41.2,89.67 D4.3
N$37
  Bottom 0.305: R50.2 R49.2
  Bottom 0.406: Q3.1 5.4,93.02 R49.2
N$39
  Bottom 0.406: R14.2 11.95,52.52 C11.2 18.15,52.52 R13.1 18.2,52.67 18.2,52.87 19.9,54.52 19.9,56.56 IC3.1
N$40  (via drill 0.3)
  Top 0.406: v20.5,90.14 20.5,78.13 22.73,75.9 SW1.P4
  Bottom 0.406: v20.5,90.14 20.5,92.96 R43.1
N$41
  Bottom 0.406: R15.1 R14.1 R16.2 | R15.1 | R15.1 9.65,54.77 C10.1
N$42  (via drill 0.3)
  Top 0.406: v33.08,82.25 v33.08,88.98
  Bottom 0.305: 11.4,93 R45.1
  Bottom 0.406: 11.4,93 11.4,91.23 13.59,89.04 33.02,89.04 v33.08,88.98 | SW1.P2 v33.08,82.25
N$43  (via drill 0.3)
  Top 0.406: v18.6,90.14 18.6,77.17 18.6,75.14 SW1.P3
  Bottom 0.406: v18.6,90.14 18.6,92.98 R44.1
N$46  (via drill 0.3)
  Top 0.406: v35,70.57 35,68.09 38.8,64.29 38.8,24.63 TR.P$3 | v4.77,87.97 12.88,87.97 12.89,87.97 v13.01,87.97
  Bottom 0.406: v35,70.57 35,86.43 33.46,87.97 26.49,87.97 | v4.77,87.97 3.76,88.98 R50.1 | 26.49,87.97 | 26.49,87.97 v13.02,87.97 v13.01,87.97
OUT_L  (via drill 0.3)
  Top 0.406: v20,51.77 20.9,51.77 22.2,50.47 22.2,44.47 v24.37,42.3 | v49.6,42.3 49.6,16.36 OUT_L.P$3
  Bottom 0.406: v20,51.77 20,52.62 arc90 R13.2 | v24.37,42.3 v49.6,42.3
OUT_R  (via drill 0.3)
  Top 0.406: v25.37,43.6 23.6,45.37 23.6,50.77 21.4,52.97 21.4,63.9 18.53,66.77 v18.5,66.77 | v54.8,43.6 54.8,3.82 OUT_R.P$3
  Bottom 0.406: R27.2 18.25,66.52 v18.5,66.77 | v54.8,43.6 v25.37,43.6

### Text on the board
tPlace: 5v | gnd | 3v3 | Rebel Technology | Tesseract Rev03 | -12V
bPlace: BOOT | 5v | gnd | 3v3 | Rebel Technology | Tesseract Rev03 | -12V